# EAGLE design radio FM (EAGLE 7.3.0)
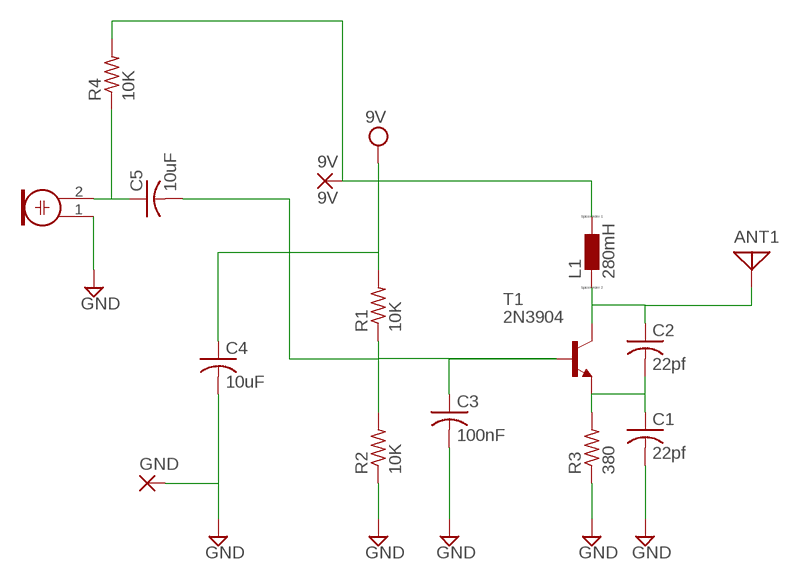
[diagram p0: schematic, sheet 1]

## Parts
9V  9V  1,6/0,8  [1,6/0,8]
ANT1  ANTENNA  [PAD-01]
C1  22pf  C-US050-025X075  [C050-025X075]
C2  22pf  C-US050-025X075  [C050-025X075]
C3  100nF  C-US050-025X075  [C050-025X075]
C4  10uF  C-US050-025X075  [C050-025X075]
C5  10uF  C-US050-025X075  [C050-025X075]
GND  1,6/0,8  [1,6/0,8]
L1  280mH  L0207/10  [0207/10]
M1  ELECTRET_MICROPHON-F6035AP  [F6035AP]
R1  10K  R-US_0207/7  [0207/7]
R2  10K  R-US_0207/7  [0207/7]
R3  380  R-US_0207/7  [0207/7]
R4  10K  R-US_0207/7  [0207/7]
T1  2N3904  [TO92]

## Nets
GND: C1.2 C3.2 C4.2 GND.1(P) M1.1 R2.1 R3.1
N$1: C3.1 C5.2 R1.1 R2.2 T1.2(B)
N$2: C5.1 M1.2 R4.1
N$9: C1.1 C2.2 R3.2 T1.3(E)
N$12: ANT1.1 C2.1 L1.2 T1.1(C)
VCC: 9V.1(P) C4.1 L1.1 R1.2 R4.2 ; supply symbol labelled 9V

## Library data of the parts
9V GND = wirepad:1,6/0,8: THROUGH-HOLE PAD
ANT1 = discrete:ANTENNA: Antenna
C1-C5 = resistor:C-US: CAPACITOR, American symbol
L1 = eagle-ltspice:L: INDUCTOR, European symbol; SPICEMODEL: NONE; SPICEPREFIX: L
M1 = microphon:ELECTRET_MICROPHON-: Electret Condenser Microphone
R1-R4 = resistor:R-US_: RESISTOR, American symbol
T1 = transistor:2N3904: NPN TRANSISTOR

## Board
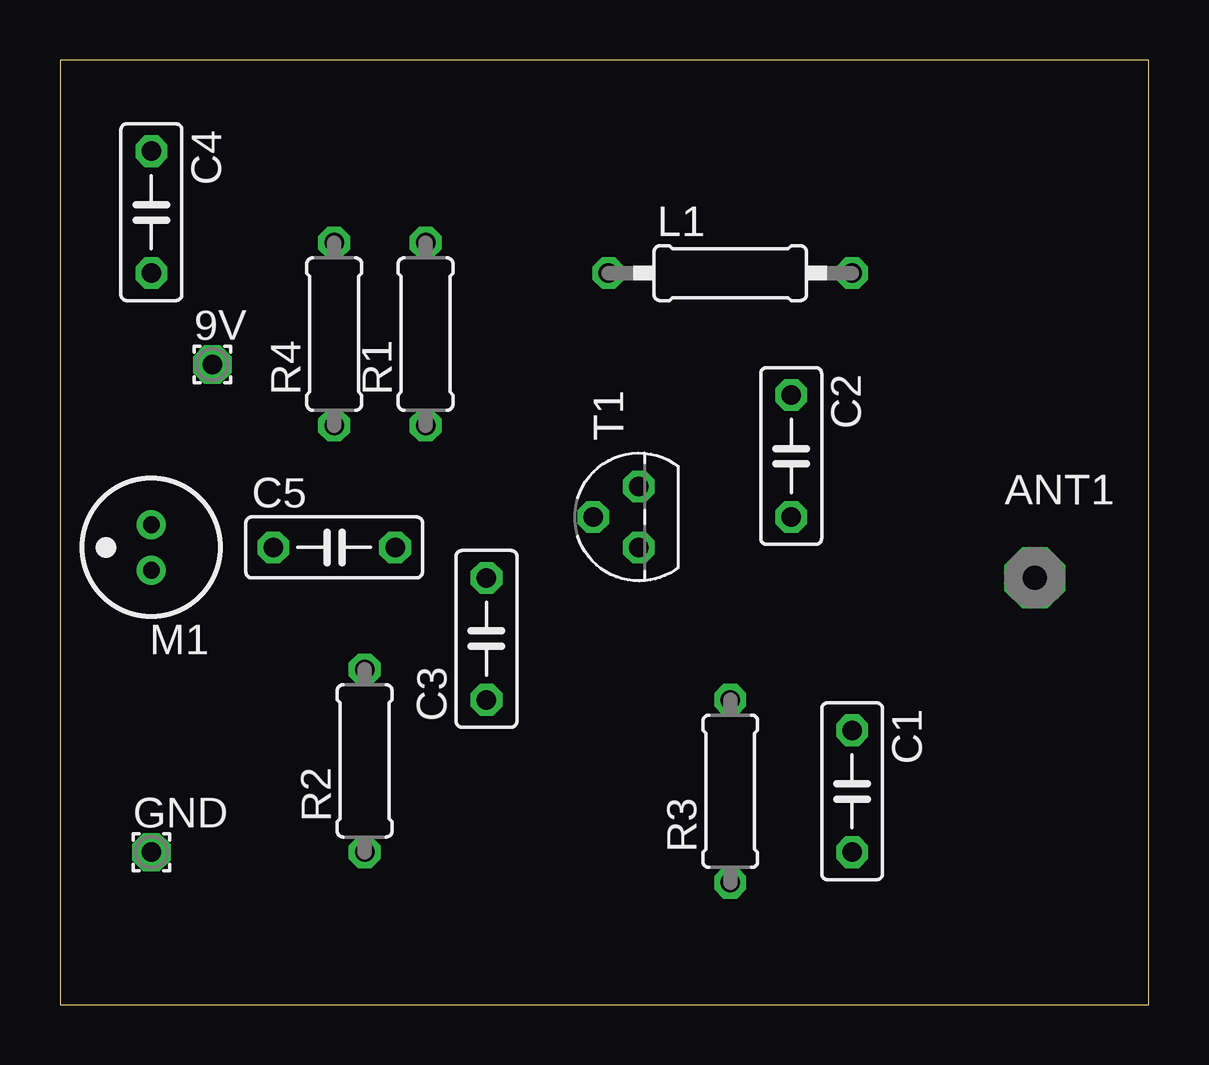
[diagram p1: board, top side]
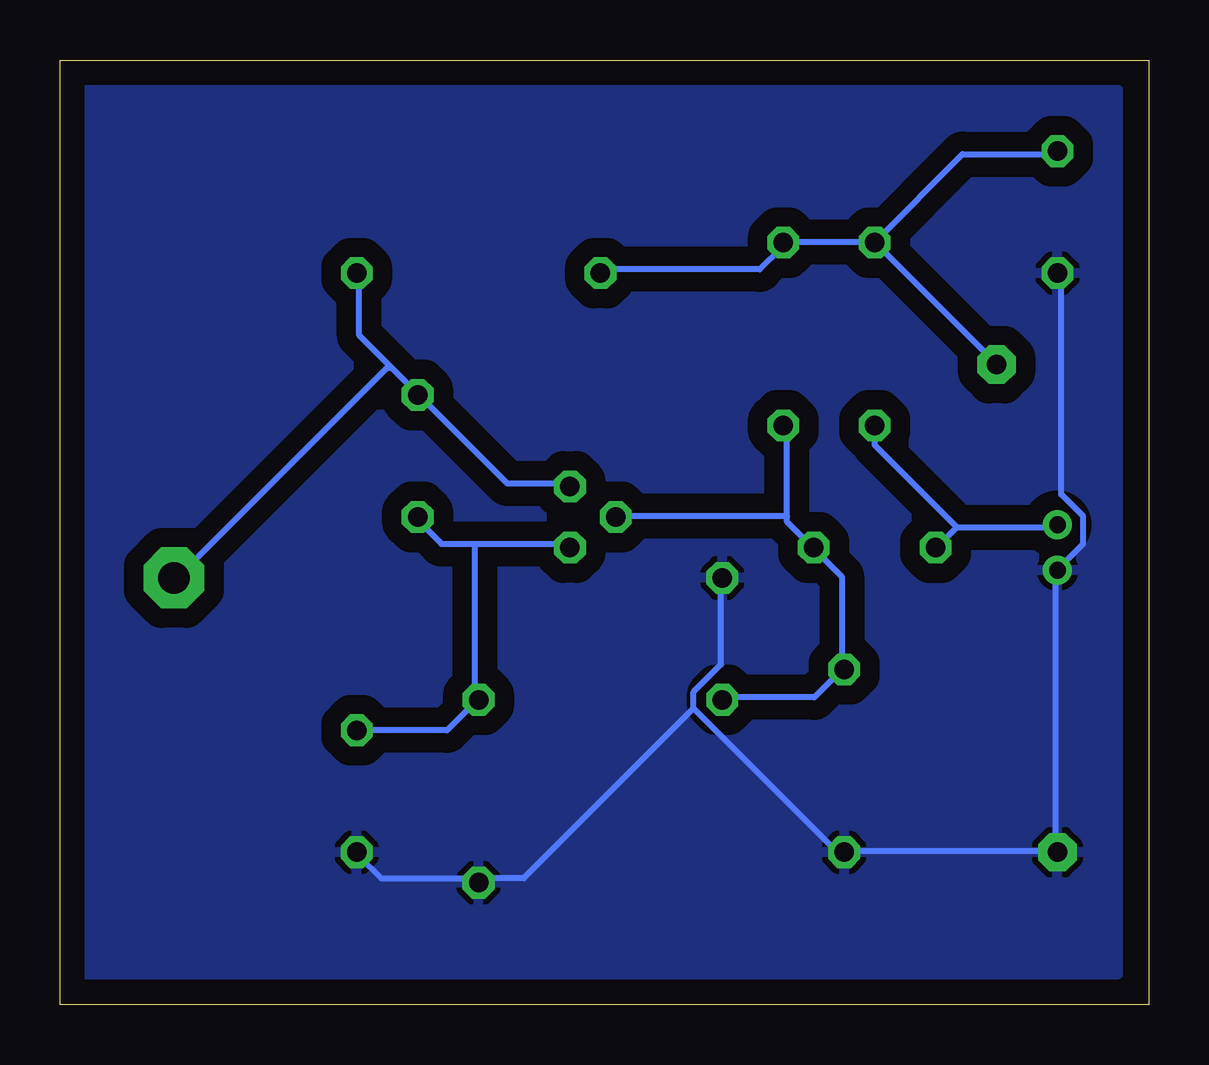
[diagram p2: board, bottom side, seen from below]

Size 45.39 x 39.36 mm. Coordinates in mm from the lower left corner, seen from the top.
Outline: 0,0 45.39,0 45.39,39.36 0,39.36 0,0
Copper layers (1*16): Top 0.035mm / dielectric 1.5mm / Bottom 0.035mm
Design rules "default": minimum track width 10mil, minimum drill 24mil, track to track 8mil, track to pad 8mil, pad to pad 8mil, via to via 8mil, smd to smd 8mil, copper to edge 40mil, drill to drill 8mil, minimum pad ring 10mil, minimum via ring 8mil, stop-mask expansion 4mil, vias tented up to drill 0mil, thermal gap 10mil

### Footprints (pad centres in the part's own frame; a part is rotated, then mirrored left to right if it is on the bottom)
1,6/0,8 = drill 0.813 pad 1.6 octagon: 1 0,0
PAD-01 = drill 1.321 pad 2.54 octagon: 1 0,0
C050-025X075 = drill 0.813 octagon: 1 -2.54,0; 2 2.54,0
0207/10 = drill 0.813 octagon: 1 -5.08,0; 2 5.08,0
F6035AP = drill 0.7 pad 1.2: 1 0,0.95; 2 0,-0.95
0207/7 = drill 0.813 octagon: 1 -3.81,0; 2 3.81,0
TO92 = drill 0.813 octagon: 1 1.27,0; 2 0,1.905; 3 -1.27,0

### Placement (x,y rotation side)
9V  6.35,26.67 0 top
ANT1  40.64,17.78 0 top
C1  33.02,8.89 270 top
C2  30.48,22.86 270 top
C3  17.78,15.24 90 top
C4  3.81,33.02 270 top
C5  11.43,19.05 0 top
GND  3.81,6.35 0 top
L1  27.94,30.48 0 top
M1  3.81,19.05 180 top
R1  15.24,27.94 90 top
R2  12.7,10.16 90 top
R3  27.94,8.89 90 top
R4  11.43,27.94 90 top
T1  24.13,20.32 90 top

### Tracks (layer width: path | path; a pad name or v marks a point on that pad's centre or on a via)
GND
  Bottom 0.254: C1.2 32.92,6.17 32,5.26 28.12,5.26 R3.1 27.89,5.26 26.06,5.26 18.97,12.34 | 3.89,6.4 3.89,18.06 M1.1 3.66,18.29 2.74,19.2 2.74,20.34 3.66,21.26 3.66,30.4 C4.2 | 3.89,6.4 12.57,6.4 R2.1 12.8,6.17 18.97,12.34 | 3.89,6.4 GND.1 | 18.97,12.34 18.97,13.03 17.83,14.17 17.83,17.6 C3.2
  pour Bottom (isolate 0.813): 1.27,38.1 44.45,38.1 44.45,1.27 1.27,1.27
N$1
  Bottom 0.254: C3.1 17.6,12.8 13.95,12.8 12.8,13.95 R2.2 12.8,14.17 12.8,17.83 13.95,18.97 C5.2 14.17,19.2 15.09,20.12 15.09,20.34 | 15.09,20.34 15.09,24 R1.1 | 15.09,20.34 22.17,20.34 T1.2
N$2
  Bottom 0.254: 8,19.89 3.89,19.89 M1.2 | 8,19.89 8.69,19.2 C5.1 | R4.1 11.43,23.32 8,19.89
N$9
  Bottom 0.254: C1.1 29.26,11.43 28.12,12.57 R3.2 28.12,12.8 28.12,19.2 | 28.12,19.2 29.49,19.2 30.4,20.12 C2.2 | 28.12,19.2 24.23,19.2 T1.3
N$12
  Bottom 0.254: T1.1 24.23,21.72 26.75,21.72 30.4,25.38 C2.1 30.63,25.6 31.55,26.52 | 31.55,26.52 32.92,27.89 32.92,30.4 L1.2 | 31.55,26.52 31.77,26.52 40.46,17.83 ANT1.1
VCC
  Bottom 0.254: 11.43,31.77 7.77,35.43 3.89,35.43 C4.1 | 11.43,31.77 15.09,31.77 R1.2 15.32,31.55 16.23,30.63 22.86,30.63 L1.1 | 11.43,31.77 6.4,26.75 9V.1 | 11.43,31.77 R4.2